# Altium schematic sheet 2_DAC_ADC.SchDoc
size A4; SheetNumber: 2; SheetTotal: 3
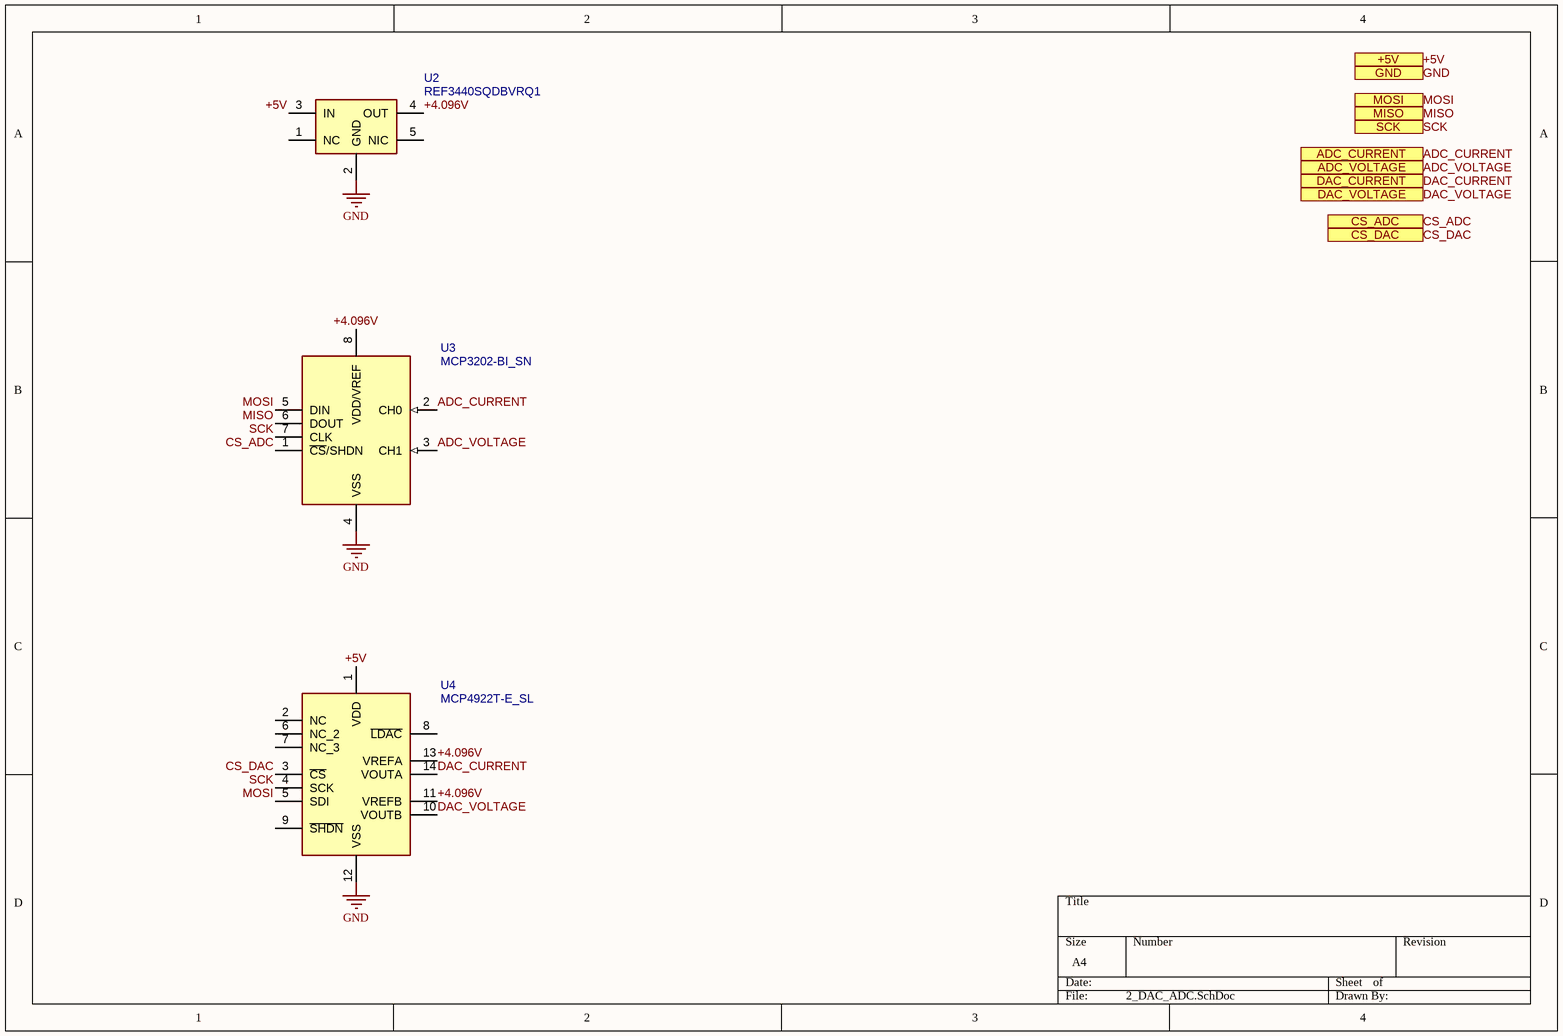
[diagram p0: 2_DAC_ADC.SchDoc]

## Parts
U2  REF3440SQDBVRQ1  [SOT95P280X145-5N]
U3  MCP3202-BI_SN  [SOIC127P600X175-8N]
U4  MCP4922T-E_SL  [SOIC127P600X175-14N]

## Ports
+5V (see 1_Controller[4A], 3_PSU[4A]), ADC_CURRENT (see 3_PSU[4A]), ADC_VOLTAGE (see 3_PSU[4A]), CS_ADC (see 1_Controller[4A]), CS_DAC (see 1_Controller[4A]), DAC_CURRENT (see 3_PSU[4A]), DAC_VOLTAGE (see 3_PSU[4A]), GND (see 1_Controller[4A], 3_PSU[4A]), MISO (see 1_Controller[4A]), MOSI (see 1_Controller[4A]), SCK (see 1_Controller[4A])

## Nets
GND: U2.2(GND) U3.4(VSS) U4.12(VSS) ; port GND
+4.096V: U2.4(OUT) U3.8(VDD/VREF) U4.11(VREFB) U4.13(VREFA)
+5V: U2.3(IN) U4.1(VDD) ; port +5V
ADC_CURRENT: U3.2(CH0) ; port ADC_CURRENT
ADC_VOLTAGE: U3.3(CH1) ; port ADC_VOLTAGE
CS_ADC: U3.1(~{CS}/SHDN) ; port CS_ADC
CS_DAC: U4.3(~{CS}) ; port CS_DAC
DAC_CURRENT: U4.14(VOUTA) ; port DAC_CURRENT
DAC_VOLTAGE: U4.10(VOUTB) ; port DAC_VOLTAGE
MISO: U3.6(DOUT) ; port MISO
MOSI: U3.5(DIN) U4.5(SDI) ; port MOSI
SCK: U3.7(CLK) U4.4(SCK) ; port SCK

Not connected (* = marked no-connect by the designer): U2 1(NC) 5(NIC); U4 2(NC) 6(NC_2) 7(NC_3) 8(~{LDAC}) 9(~{SHDN})

## Library data of the parts
U2 = REF3440SQDBVRQ1: Integrated Circuit; Manufacturer_Name: Texas Instruments; Datasheet Link: https://www.ti.com/lit/gpn/REF34-Q1; Height: 1.45mm; Manufacturer_Part_Number: REF3440SQDBVRQ1; Mouser Part Number: 595-REF3440SQDBVRQ1; Mouser Price/Stock: https://www.mouser.co.uk/ProductDetail/Texas-Instruments/REF3440SQDBVRQ1?qs=bAKSY%2FctAC6om7nW8LpN%2Fg%3D%3D; Arrow Part Number: REF3440SQDBVRQ1; Arrow Price/Stock: https://www.arrow.com/en/products/ref3440sqdbvrq1/texas-instruments?region=nac
U3 = MCP3202-BI_SN: Integrated Circuit; Manufacturer_Name: Microchip; Manufacturer_Part_Number: MCP3202-BI/SN; Datasheet Link: https://datasheet.datasheetarchive.com/originals/distributors/Datasheets-19/DSA-360813.pdf; Height: 1.75mm; Mouser Part Number: 579-MCP3202BISN; Mouser Price/Stock: https://www.mouser.co.uk/ProductDetail/Microchip-Technology-Atmel/MCP3202-BI-SN?qs=C%252BuF95oynlkGMhp5%2FSqbew%3D%3D; Arrow Part Number: MCP3202-BI/SN; Arrow Price/Stock: https://www.arrow.com/en/products/mcp3202-bisn/microchip-technology?region=nac
U4 = MCP4922T-E_SL: Undefined or Miscellaneous; Manufacturer_Name: Microchip; Manufacturer_Part_Number: MCP4922T-E/SL; Datasheet Link: http://ww1.microchip.com/downloads/en/DeviceDoc/22250A.pdf; Height: 1.75mm; Mouser Part Number: 579-MCP4922T-E/SL; Mouser Price/Stock: https://www.mouser.co.uk/ProductDetail/Microchip-Technology-Atmel/MCP4922T-E-SL?qs=8U9qMIGhlkqc26Xt7UKk2w%3D%3D; Arrow Part Number: MCP4922T-E/SL; Arrow Price/Stock: https://www.arrow.com/en/products/mcp4922t-esl/microchip-technology?region=nac